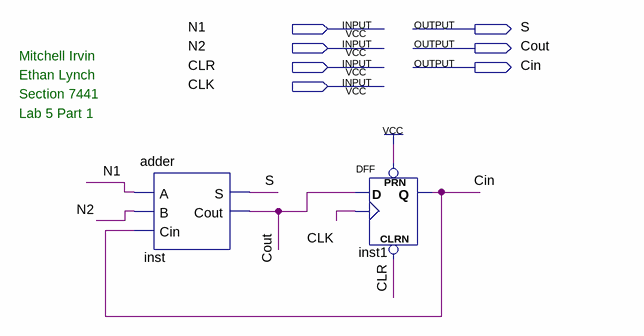
[diagram p0: schematic sheet]
// Quartus schematic lab5part1.bdf as structural Verilog: 2 symbols, 7 pins
module lab5part1 (
  input  N1,
  input  N2,
  input  CLR,
  input  CLK,
  output S,
  output Cout,
  output Cin
);

  adder inst (.A(N1), .B(N2), .Cin(Cin), .S(S), .Cout(Cout));
  DFF inst1 (.CLRN(CLR), .CLK(CLK), .D(Cout), .PRN(1'b1), .Q(Cin));

  // Notes on the sheet:
  //   Mitchell Irvin
  //   Ethan Lynch
  //   Section 7441
  //   Lab 5 Part 1
endmodule
